# Altium schematic sheet SensorBoard.SchDoc
size A3
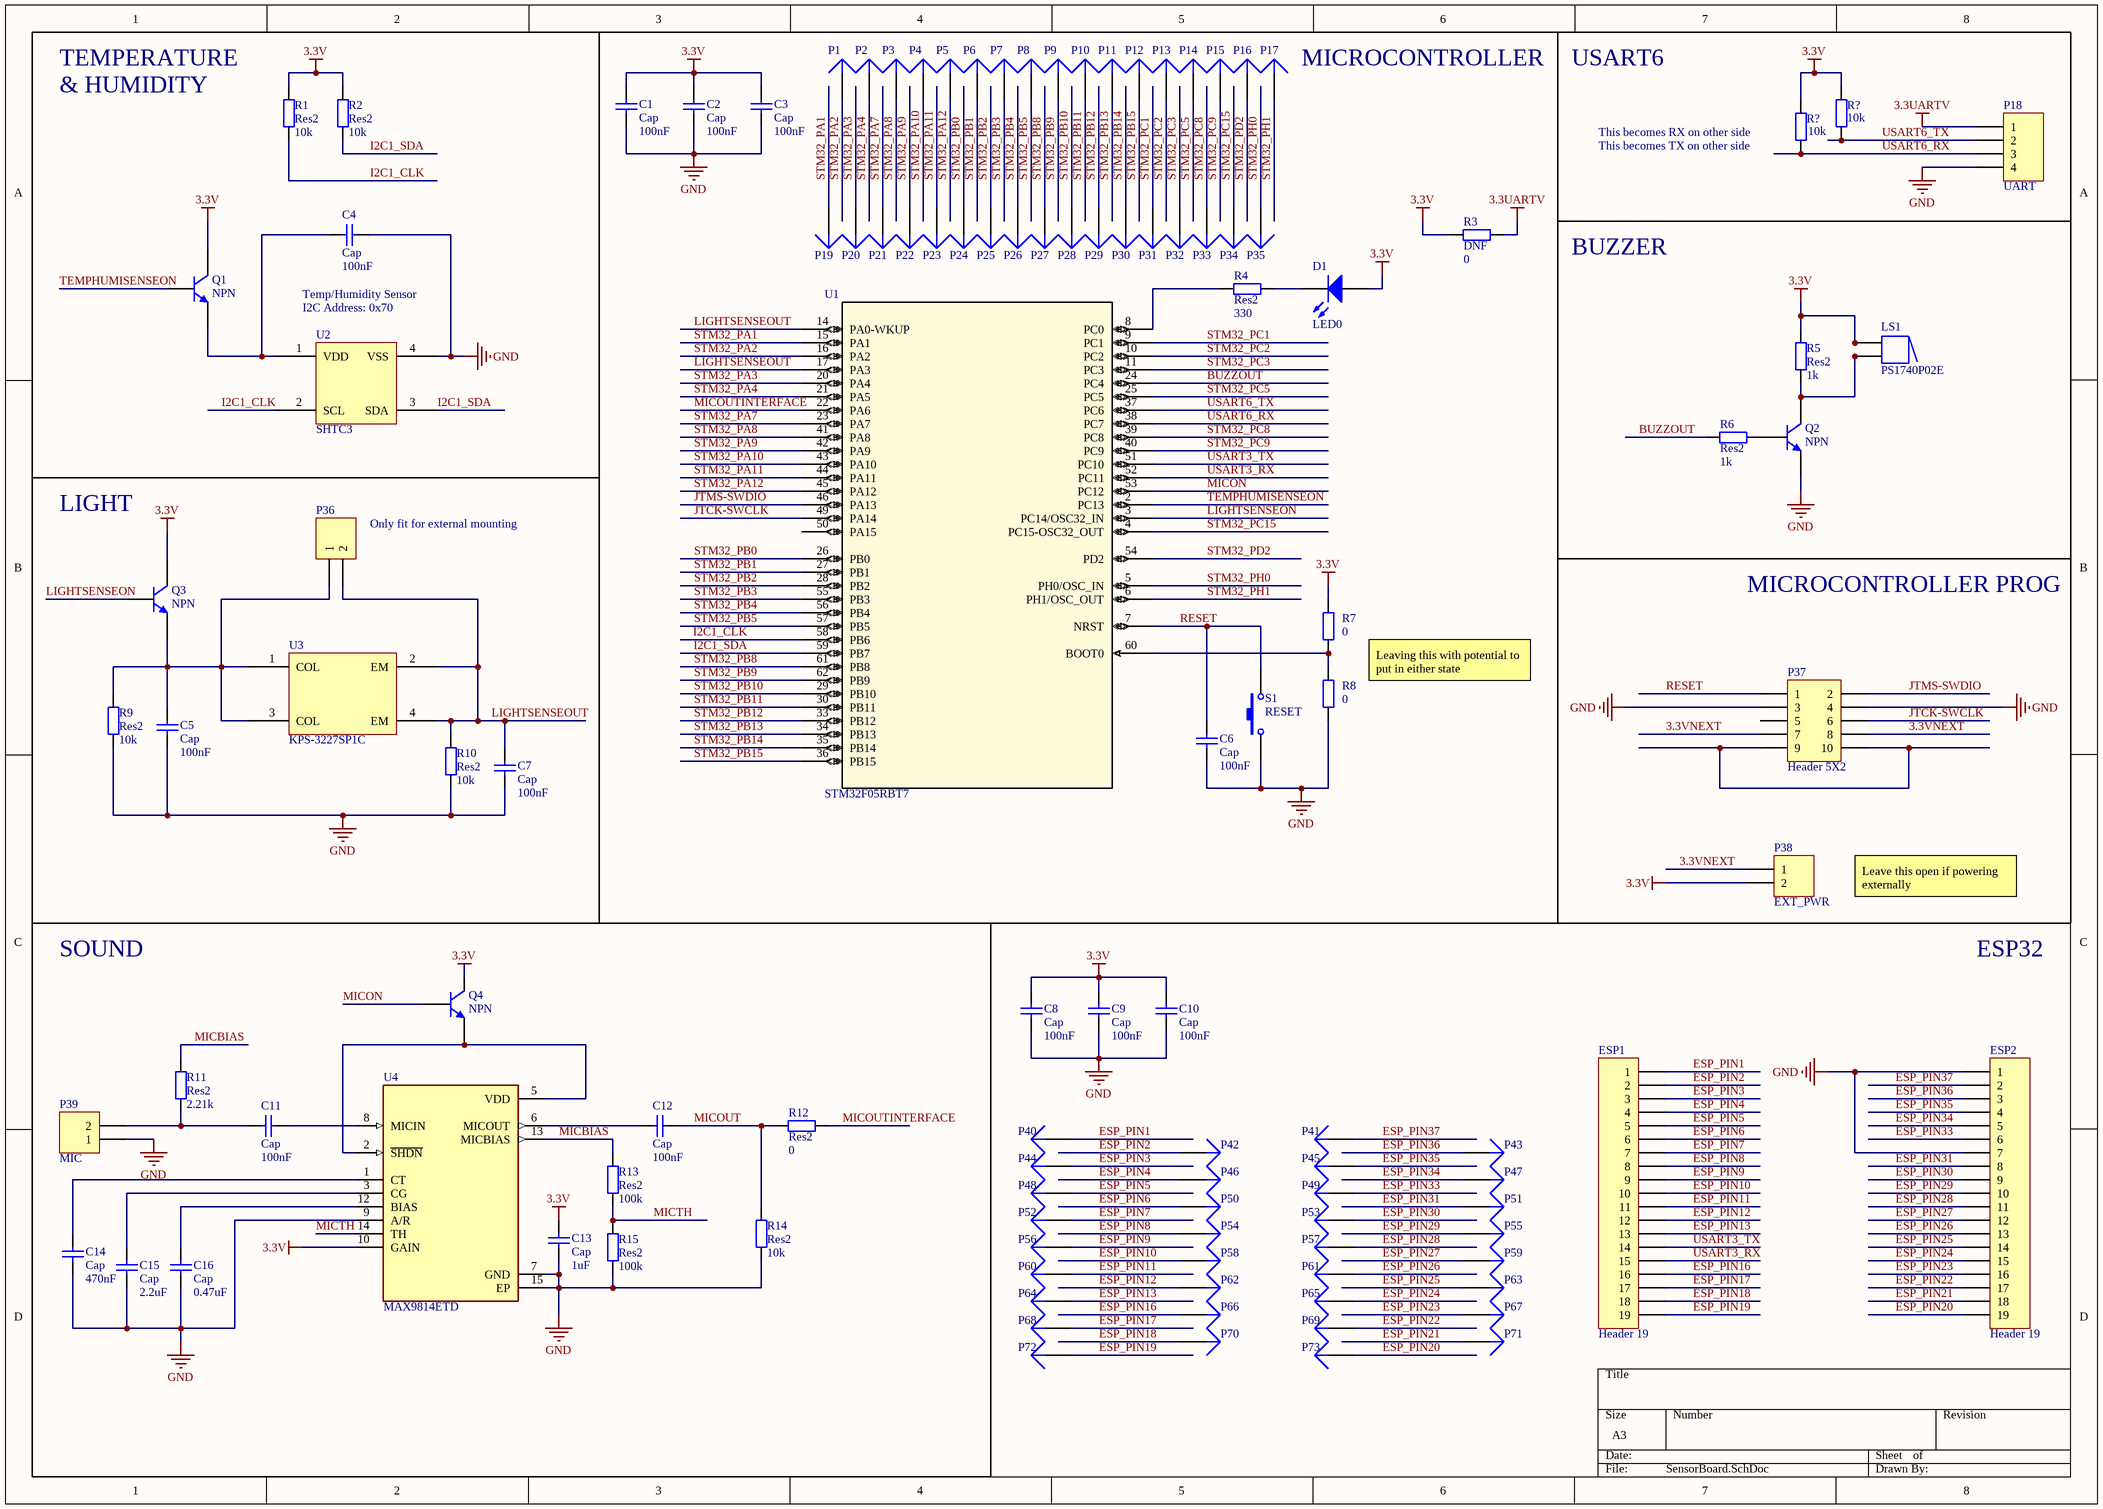
[diagram p0: SensorBoard.SchDoc]

## Parts
(Parts that share a designator on the sheet are numbered #1, #2 ... from top to bottom, then left to right.)
C1  Cap  value 100nF  [1608[0603]]
C2  Cap  value 100nF  [1608[0603]]
C3  Cap  value 100nF  [1608[0603]]
C4  Cap  value 100nF  [1608[0603]]
C5  Cap  value 100nF  [1608[0603]]
C6  Cap  value 100nF  [1608[0603]]
C7  Cap  value 100nF  [1608[0603]]
C8  Cap  value 100nF  [1608[0603]]
C9  Cap  value 100nF  [1608[0603]]
C10  Cap  value 100nF  [1608[0603]]
C11  Cap  value 100nF  [1608[0603]]
C12  Cap  value 100nF  [1608[0603]]
C13  Cap  value 1uF  [1608[0603]]
C14  Cap  value 470nF  [1608[0603]]
C15  Cap  value 2.2uF  [1608[0603]]
C16  Cap  value 0.47uF  [1608[0603]]
D1  LED0  [LED-0]
ESP1  Header 19  [HDR1X19]
ESP2  Header 19  [HDR1X19]
LS1  PS1740P02E  [ABSM-1574]
P1  Plug  [PIN1]  (value not drawn)
P2  Plug  [PIN1]  (value not drawn)
P3  Plug  [PIN1]  (value not drawn)
P4  Plug  [PIN1]  (value not drawn)
P5  Plug  [PIN1]  (value not drawn)
P6  Plug  [PIN1]  (value not drawn)
P7  Plug  [PIN1]  (value not drawn)
P8  Plug  [PIN1]  (value not drawn)
P9  Plug  [PIN1]  (value not drawn)
P10  Plug  [PIN1]  (value not drawn)
P11  Plug  [PIN1]  (value not drawn)
P12  Plug  [PIN1]  (value not drawn)
P13  Plug  [PIN1]  (value not drawn)
P14  Plug  [PIN1]  (value not drawn)
P15  Plug  [PIN1]  (value not drawn)
P16  Plug  [PIN1]  (value not drawn)
P17  Plug  [PIN1]  (value not drawn)
P18  UART  [HDR1X4]
P19  Plug  [PIN1]  (value not drawn)
P20  Plug  [PIN1]  (value not drawn)
P21  Plug  [PIN1]  (value not drawn)
P22  Plug  [PIN1]  (value not drawn)
P23  Plug  [PIN1]  (value not drawn)
P24  Plug  [PIN1]  (value not drawn)
P25  Plug  [PIN1]  (value not drawn)
P26  Plug  [PIN1]  (value not drawn)
P27  Plug  [PIN1]  (value not drawn)
P28  Plug  [PIN1]  (value not drawn)
P29  Plug  [PIN1]  (value not drawn)
P30  Plug  [PIN1]  (value not drawn)
P31  Plug  [PIN1]  (value not drawn)
P32  Plug  [PIN1]  (value not drawn)
P33  Plug  [PIN1]  (value not drawn)
P34  Plug  [PIN1]  (value not drawn)
P35  Plug  [PIN1]  (value not drawn)
P36  Only fit for external mounting  [HDR1X2]
P37  Header 5X2  [HDR2X5]
P38  EXT_PWR  [HDR1X2]
P39  MIC  [HDR1X2]
P40  Plug  [PIN1]  (value not drawn)
P41  Plug  [PIN1]  (value not drawn)
P42  Plug  [PIN1]  (value not drawn)
P43  Plug  [PIN1]  (value not drawn)
P44  Plug  [PIN1]  (value not drawn)
P45  Plug  [PIN1]  (value not drawn)
P46  Plug  [PIN1]  (value not drawn)
P47  Plug  [PIN1]  (value not drawn)
P48  Plug  [PIN1]  (value not drawn)
P49  Plug  [PIN1]  (value not drawn)
P50  Plug  [PIN1]  (value not drawn)
P51  Plug  [PIN1]  (value not drawn)
P52  Plug  [PIN1]  (value not drawn)
P53  Plug  [PIN1]  (value not drawn)
P54  Plug  [PIN1]  (value not drawn)
P55  Plug  [PIN1]  (value not drawn)
P56  Plug  [PIN1]  (value not drawn)
P57  Plug  [PIN1]  (value not drawn)
P58  Plug  [PIN1]  (value not drawn)
P59  Plug  [PIN1]  (value not drawn)
P60  Plug  [PIN1]  (value not drawn)
P61  Plug  [PIN1]  (value not drawn)
P62  Plug  [PIN1]  (value not drawn)
P63  Plug  [PIN1]  (value not drawn)
P64  Plug  [PIN1]  (value not drawn)
P65  Plug  [PIN1]  (value not drawn)
P66  Plug  [PIN1]  (value not drawn)
P67  Plug  [PIN1]  (value not drawn)
P68  Plug  [PIN1]  (value not drawn)
P69  Plug  [PIN1]  (value not drawn)
P70  Plug  [PIN1]  (value not drawn)
P71  Plug  [PIN1]  (value not drawn)
P72  Plug  [PIN1]  (value not drawn)
P73  Plug  [PIN1]  (value not drawn)
Q1  NPN  [SOT23_N]
Q2  NPN  [SOT23_N]
Q3  NPN  [SOT23_N]
Q4  NPN  [SOT23_N]
R1  Res2  value 10k  [0603]
R2  Res2  value 10k  [0603]
R3  DNF  value 0  [0603]
R4  Res2  value 330  [0603]
R5  Res2  value 1k  [0603]
R6  Res2  value 1k  [0603]
R7  value 0  [0603]  (hidden comment: Res2)
R8  value 0  [0603]  (hidden comment: Res2)
R9  Res2  value 10k  [0603]
R10  Res2  value 10k  [0603]
R11  Res2  value 2.21k  [0603]
R12  Res2  value 0  [0603]
R13  Res2  value 100k  [0603]
R14  Res2  value 10k  [0603]
R15  Res2  value 100k  [0603]
R?#1  value 10k  [0603]  (hidden comment: Res2)
R?#2  value 10k  [0603]  (hidden comment: Res2)
S1  RESET  [SPST-2]
U1  STM32F05RBT7
U2  SHTC3
U3  KPS-3227SP1C
U4  MAX9814ETD  [MAX9814ETD]

## Blocks framed on the sheet
LIGHT: C5 C7 P36 Q3 R9 R10 U3
SOUND: C11-C16 P39 Q4 R11-R15 U4

## Nets
3.3UARTV: P18.1 R3.2
3.3V: C1.2 C2.2 C3.2 C8.2 C9.2 C10.2 C13.1 D1.1(A) LS1.1 LS1.1A P38.2 Q1.1(C) Q3.1(C) Q4.1(C) R1.2 R2.2 R3.1 R5.2 R7.2 R?#1.2 R?#2.2 U4.10(GAIN)
GND: C1.1 C2.1 C3.1 C4.2 C5.1 C6.1 C7.1 C8.1 C9.1 C10.1 C13.2 C14.2 C15.2 C16.2 ESP2.1 ESP2.7 P18.4 P37.3 P37.4 P39.1 Q2.3(E) R8.1 R9.1 R10.1 R14.1 R15.1 S1.1 U2.4(VSS) U4.7(GND) U4.9(A/R) U4.15(EP)
3.3VNEXT: P37.7 P37.8 P38.1
BUZZOUT: R6.1 U1.24(PC4)
ESP_PIN1: ESP1.1 P40.1
ESP_PIN2: ESP1.2 P42.1
ESP_PIN3: ESP1.3 P44.1
ESP_PIN4: ESP1.4 P46.1
ESP_PIN5: ESP1.5 P48.1
ESP_PIN6: ESP1.6 P50.1
ESP_PIN7: ESP1.7 P52.1
ESP_PIN8: ESP1.8 P54.1
ESP_PIN9: ESP1.9 P56.1
ESP_PIN10: ESP1.10 P58.1
ESP_PIN11: ESP1.11 P60.1
ESP_PIN12: ESP1.12 P62.1
ESP_PIN13: ESP1.13 P64.1
ESP_PIN16: ESP1.16 P66.1
ESP_PIN17: ESP1.17 P68.1
ESP_PIN18: ESP1.18 P70.1
ESP_PIN19: ESP1.19 P72.1
ESP_PIN20: ESP2.19 P73.1
ESP_PIN21: ESP2.18 P71.1
ESP_PIN22: ESP2.17 P69.1
ESP_PIN23: ESP2.16 P67.1
ESP_PIN24: ESP2.15 P65.1
ESP_PIN25: ESP2.14 P63.1
ESP_PIN26: ESP2.13 P61.1
ESP_PIN27: ESP2.12 P59.1
ESP_PIN28: ESP2.11 P57.1
ESP_PIN29: ESP2.10 P55.1
ESP_PIN30: ESP2.9 P53.1
ESP_PIN31: ESP2.8 P51.1
ESP_PIN33: ESP2.6 P49.1
ESP_PIN34: ESP2.5 P47.1
ESP_PIN35: ESP2.4 P45.1
ESP_PIN36: ESP2.3 P43.1
ESP_PIN37: ESP2.2 P41.1
I2C1_CLK: R1.1 U1.58(PB6) U2.2(SCL)
I2C1_SDA: R2.1 U1.59(PB7) U2.3(SDA)
JTCK-SWCLK: P37.6 U1.49(PA14)
JTMS-SWDIO: P37.2 U1.46(PA13)
LIGHTSENSEON: Q3.2(B) U1.3(PC14/OSC32_IN)
LIGHTSENSEOUT: C7.2 P36.2 R10.2 U1.14(PA0-WKUP) U1.17(PA3) U3.2(EM) U3.4(EM)
MICBIAS: R11.2 R13.2 U4.13(MICBIAS)
MICON: Q4.2(B) U1.53(PC12)
MICOUT: C12.2 R12.2 R14.2
MICOUTINTERFACE: R12.1 U1.22(PA6)
MICTH: R13.1 R15.2 U4.14(TH)
RESET: C6.2 P37.1 S1.2 U1.7(NRST)
STM32_PA1: P19.1 U1.15(PA1)
STM32_PA2: P1.1 U1.16(PA2)
STM32_PA3: P20.1 U1.20(PA4)
STM32_PA4: P2.1 U1.21(PA5)
STM32_PA7: P21.1 U1.23(PA7)
STM32_PA8: P3.1 U1.41(PA8)
STM32_PA9: P22.1 U1.42(PA9)
STM32_PA10: P4.1 U1.43(PA10)
STM32_PA11: P23.1 U1.44(PA11)
STM32_PA12: P5.1 U1.45(PA12)
STM32_PB0: P24.1 U1.26(PB0)
STM32_PB1: P6.1 U1.27(PB1)
STM32_PB2: P25.1 U1.28(PB2)
STM32_PB3: P7.1 U1.55(PB3)
STM32_PB4: P26.1 U1.56(PB4)
STM32_PB5: P8.1 U1.57(PB5)
STM32_PB8: P27.1 U1.61(PB8)
STM32_PB9: P9.1 U1.62(PB9)
STM32_PB10: P28.1 U1.29(PB10)
STM32_PB11: P10.1 U1.30(PB11)
STM32_PB12: P29.1 U1.33(PB12)
STM32_PB13: P11.1 U1.34(PB13)
STM32_PB14: P30.1 U1.35(PB14)
STM32_PB15: P12.1 U1.36(PB15)
STM32_PC1: P31.1 U1.9(PC1)
STM32_PC2: P13.1 U1.10(PC2)
STM32_PC3: P32.1 U1.11(PC3)
STM32_PC5: P14.1 U1.25(PC5)
STM32_PC8: P33.1 U1.39(PC8)
STM32_PC9: P15.1 U1.40(PC9)
STM32_PC15: P34.1 U1.4(PC15-OSC32_OUT)
STM32_PD2: P16.1 U1.54(PD2)
STM32_PH0: P35.1 U1.5(PH0/OSC_IN)
STM32_PH1: P17.1 U1.6(PH1/OSC_OUT)
TEMPHUMISENSEON: Q1.2(B) U1.2(PC13)
USART3_RX: ESP1.15 U1.52(PC11)
USART3_TX: ESP1.14 U1.51(PC10)
USART6_RX: P18.3 R?#2.1 U1.38(PC7)
USART6_TX: P18.2 R?#1.1 U1.37(PC6)
NetC4_1: C4.1 Q1.3(E) U2.1(VDD)
NetC5_2: C5.2 P36.1 Q3.3(E) R9.2 U3.1(COL) U3.3(COL)
NetC11_1: C11.1 P39.2 R11.1
NetC11_2: C11.2 U4.8(MICIN)
NetC12_1: C12.1 U4.6(MICOUT)
NetC14_1: C14.1 U4.1(CT)
NetC15_1: C15.1 U4.3(CG)
NetC16_1: C16.1 U4.12(BIAS)
NetD1_2: D1.2(K) R4.1
NetLS1_2: LS1.2 LS1.2A Q2.1(C) R5.1
NetP37_9: P37.9 P37.10
NetQ2_2: Q2.2(B) R6.2
NetQ4_3: Q4.3(E) U4.2(~{SHDN}) U4.5(VDD)
NetR4_2: R4.2 U1.8(PC0)
NetR7_1: R7.1 R8.2 U1.60(BOOT0)

Not connected (* = marked no-connect by the designer): P37 5; U1 50(PA15)

## Notes on the sheet
- TEMPERATURE
- & HUMIDITY
- (near P17) MICROCONTROLLER
- USART6
- (near R?#2) This becomes RX on other side
- (near R?#2) This becomes TX on other side
- Temp/Humidity Sensor
- (near U2) I2C Address: 0x70
- BUZZER
- MICROCONTROLLER PROG
- Leaving this with potential to put in either state
- Leave this open if powering externally
- ESP32

## Library data of the parts
C1-C16 = Cap: Capacitor; Published: 8-Jun-2000; LatestRevisionDate: 17-Jul-2002; LatestRevisionNote: Re-released for DXP Platform.; PackageReference: RAD-0.3; Publisher: Altium Limited; PackageDescription: Radial Cap, Thru-Hole; 2 Leads; 0.3 in Pin Spacing
D1 = LED0: Typical INFRARED GaAs LED; Published: 8-Jun-2000; LatestRevisionDate: 08-Jul-2005; LatestRevisionNote: Mech Layer 1 removed.; PackageReference: LED-0; Publisher: Altium Limited; PackageDescription: LED; 2 Leads
ESP1 ESP2 = Header 19: Header, 19-Pin; LatestRevisionDate: 17-Jul-2002; LatestRevisionNote: Re-released for DXP Platform.; Publisher: Altium Limited
LS1 = Buzzer: Magnetic Transducer Buzzer; Published: 24-Mar-1999; LatestRevisionDate: 17-Dec-2003; LatestRevisionNote: Schematic revised, PCB Footprint replaced.; DatasheetVersion: 17-Dec-2003; PackageReference: ABSM-1574; Publisher: Altium Limited; PackageDescription: Magnetic Transducer Buzzer; ComponentLink1Description: Manufacturer Link; ComponentLink1URL: http://www.megastar.com/linecard/buzzmode/index.php
P18 = Header 4: Header, 4-Pin; LatestRevisionDate: 17-Jul-2002; LatestRevisionNote: Re-released for DXP Platform.; Publisher: Altium Limited
P36 P38 P39 = Header 2: Header, 2-Pin; LatestRevisionDate: 17-Jul-2002; LatestRevisionNote: Re-released for DXP Platform.; Publisher: Altium Limited
P37 = Header 5X2: Header, 5-Pin, Dual row; LatestRevisionDate: 17-Jul-2002; LatestRevisionNote: Re-released for DXP Platform.; Publisher: Altium Limited
Q1-Q4 = NPN: NPN Bipolar Transistor; Published: 8-Jun-2000; LatestRevisionDate: 17-Jul-2002; LatestRevisionNote: Re-released for DXP Platform.; PackageReference: TO-226-AA; Publisher: Altium Limited; PackageDescription: TO, Flat Index; 3 In-Line, Axial Leads; Body Dia. 4.8mm; Leads 0.55 x 0.51 mm (max); Code_JEDEC: TO-226-AA
R1-R15 R?#1 R?#2 = Res2: Resistor; Published: 8-Jun-2000; LatestRevisionDate: 17-Jul-2002; LatestRevisionNote: Re-released for DXP Platform.; PackageReference: AXIAL-0.4; Publisher: Altium Limited; PackageDescription: Axial Device, Thru-Hole; 2 Leads; 0.4 in Pin Spacing
S1 = SW-PB: Switch; Published: 24-Mar-1999; LatestRevisionDate: 17-Jul-2002; LatestRevisionNote: Re-released for DXP Platform.; PackageReference: SPST-2; Publisher: Altium Limited; PackageDescription: Switch; 2 Leads
U2 = SHTC3: Manufacturer: Sensirion; Manufacturer Number: SHTC3
P1-P17 P19-P35 P40-P73 = Plug: LatestRevisionDate: 17-Jul-2002; LatestRevisionNote: Re-released for DXP Platform.; Publisher: Altium Limited